# EAGLE design kludge2 (EAGLE 6.6.0)
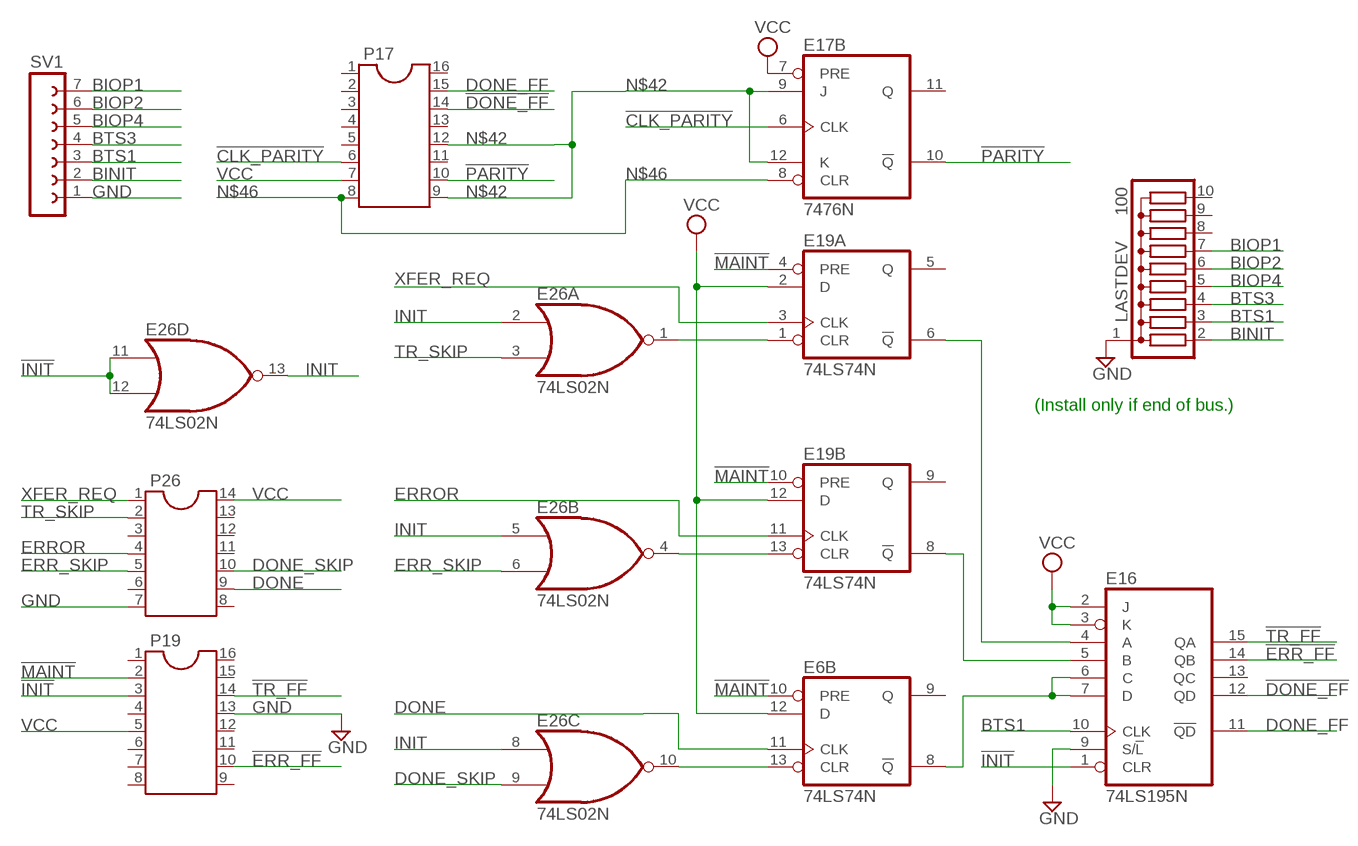
[diagram p0: schematic, sheet 1]

## Parts
E6  74LS74N  [DIL14]
E16  74LS195N  [DIL16]
E17  7476N  [DIL16]
E19  74LS74N  [DIL14]
E26  74LS02N  [DIL14]
LASTDEV  100  G09R  [SIL10]
P17  DIL16  [DIL16]
P19  DIL16  [DIL16]
P26  DIL14  [DIL14]
SV1  FE07-1  [FE07]

## Nets
!CLK_PARITY: E17.6(B:CLK) P17.6
!DONE_FF: E16.12(QD) P17.14
!ERR_FF: E16.14(QB) P19.10
!INIT: E16.1(CLR) E26.11(D:I0) E26.12(D:I1) P19.3
!MAINT: E6.10(B:PRE) E19.4(A:PRE) E19.10(B:PRE) P19.2
!PARITY: E17.10(B:!Q) P17.10
!TR_FF: E16.15(QA) P19.14
BINIT: LASTDEV.2 SV1.2
BIOP1: LASTDEV.7 SV1.7
BIOP2: LASTDEV.6 SV1.6
BIOP4: LASTDEV.5 SV1.5
BTS1: E16.10(CLK) LASTDEV.3 SV1.3
BTS3: LASTDEV.4 SV1.4
DONE: E6.11(B:CLK) P26.9
DONE_FF: E16.11(!QD) P17.15
DONE_SKIP: E26.9(C:I1) P26.10
ERR_SKIP: E26.6(B:I1) P26.5
ERROR: E19.11(B:CLK) P26.4
GND [supply]: E16.9(S/!L) LASTDEV.1 P19.13 P26.7 SV1.1
INIT: E26.2(A:I0) E26.5(B:I0) E26.8(C:I0) E26.13(D:O)
N$42: E17.9(B:J) E17.12(B:K) P17.9 P17.12
N$46: E17.8(B:CLR) P17.8
N$100: E16.4(A) E19.6(A:!Q)
N$103: E16.5(B) E19.8(B:!Q)
N$107: E6.8(B:!Q) E16.6(C) E16.7(D)
N$108: E19.1(A:CLR) E26.1(A:O)
N$110: E19.13(B:CLR) E26.4(B:O)
N$111: E6.13(B:CLR) E26.10(C:O)
TR_SKIP: E26.3(A:I1) P26.2
VCC [supply]: E6.12(B:D) E16.2(J) E16.3(K) E17.7(B:PRE) E19.2(A:D) E19.12(B:D) P17.7 P19.5 P26.14
XFER_REQ: E19.3(A:CLK) P26.1
Unconnected: E6.1(A:CLR) E6.2(A:D) E6.3(A:CLK) E6.4(A:PRE) E6.5(A:Q) E6.6(A:!Q) E6.9(B:Q) E16.13(QC) E17.1(A:CLK) E17.2(A:PRE) E17.3(A:CLR) E17.4(A:J) E17.11(B:Q) E17.14(A:!Q) E17.15(A:Q) E17.16(A:K) E19.5(A:Q) E19.9(B:Q) LASTDEV.8 LASTDEV.9 LASTDEV.10 P17.1 P17.2 P17.3 P17.4 P17.5 P17.11 P17.13 P17.16 P19.1 P19.4 P19.6 P19.7 P19.8 P19.9 P19.11 P19.12 P19.15 P19.16 P26.3 P26.6 P26.8 P26.11 P26.12 P26.13

## Notes on the sheet
- (Install only if end of bus.)

## Power pins joined to a net without a drawn wire
GND: E6.7(P:GND) E16.8(GND) E17.13(P:GND) E19.7(P:GND) E26.7(P:GND)
VCC: E6.14(P:VCC) E16.16(VCC) E17.5(P:VCC) E19.14(P:VCC) E26.14(P:VCC)

## Library data of the parts
E6 E19 = 74xx-us:74*74: Dual D type positive edge triggered FLIP FLOP, preset and clear
E16 = 74xx-us:74*195: 4-bit parallel access SHIFT REGISTER
E17 = 74xx-us:74*76: Dual J-K FLIP FLOP, preset and clear
E26 = 74xx-us:74*02: Quad 2-input NOR gate
LASTDEV = resistor-sil:G09R: SIL RESISTOR; OC_FARNELL: unknown; OC_NEWARK: unknown
P17 P19 = ic-package:DIL16: Dual In Line / Socket
P26 = ic-package:DIL14: Dual In Line / Socket
SV1 = con-lsta:FE07-1: FEMALE HEADER; OC_FARNELL: unknown; OC_NEWARK: unknown

## Net classes
1 supply: width 0.508 mm

## Board
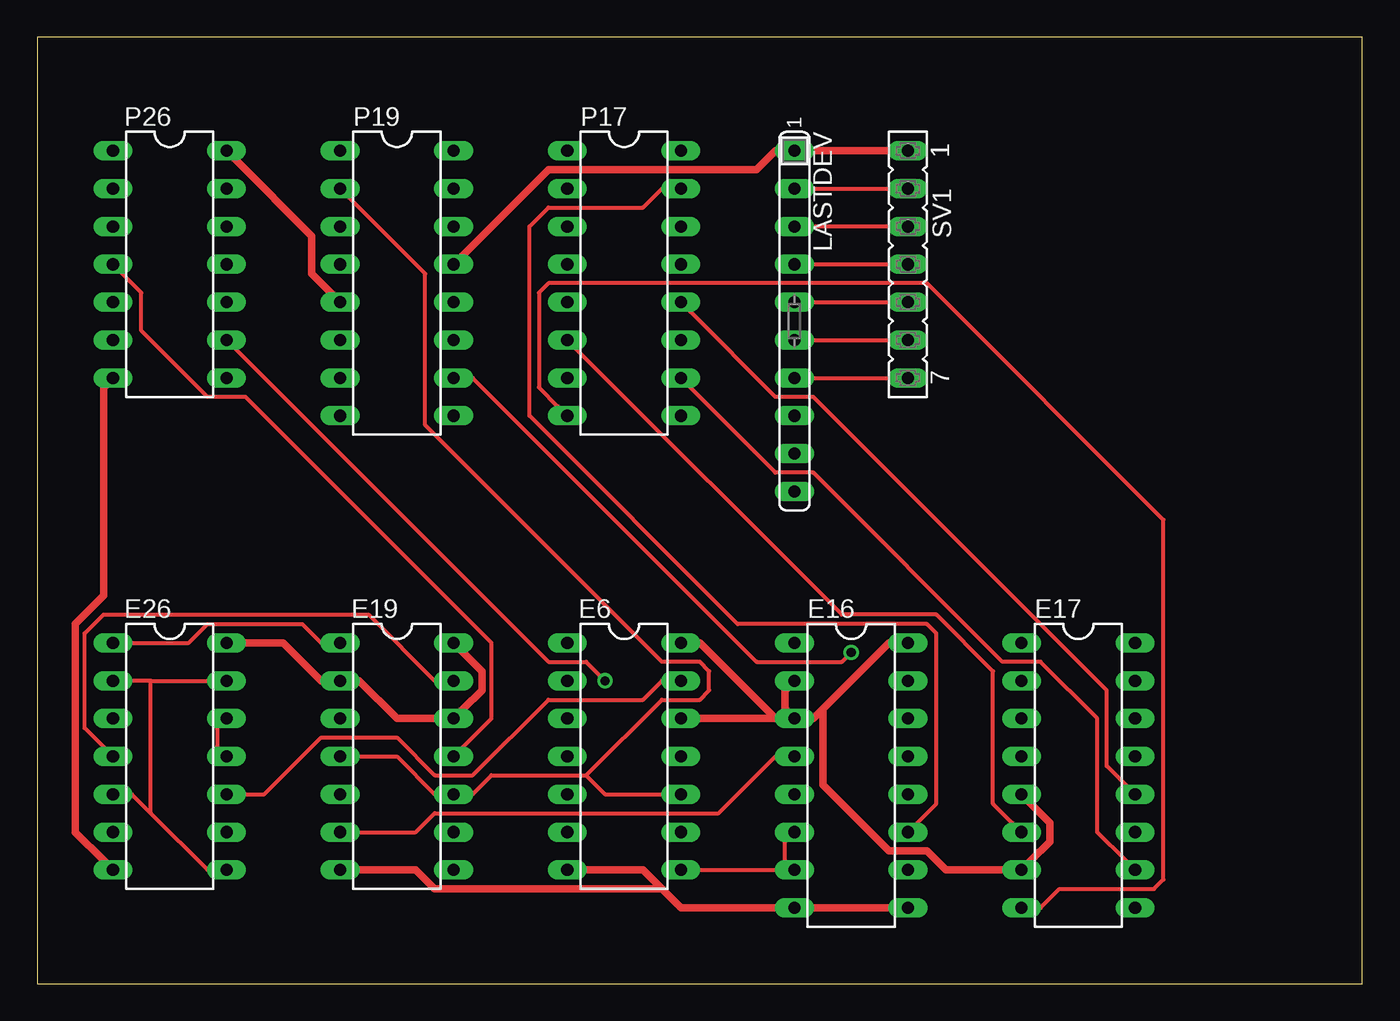
[diagram p1: board, top side]
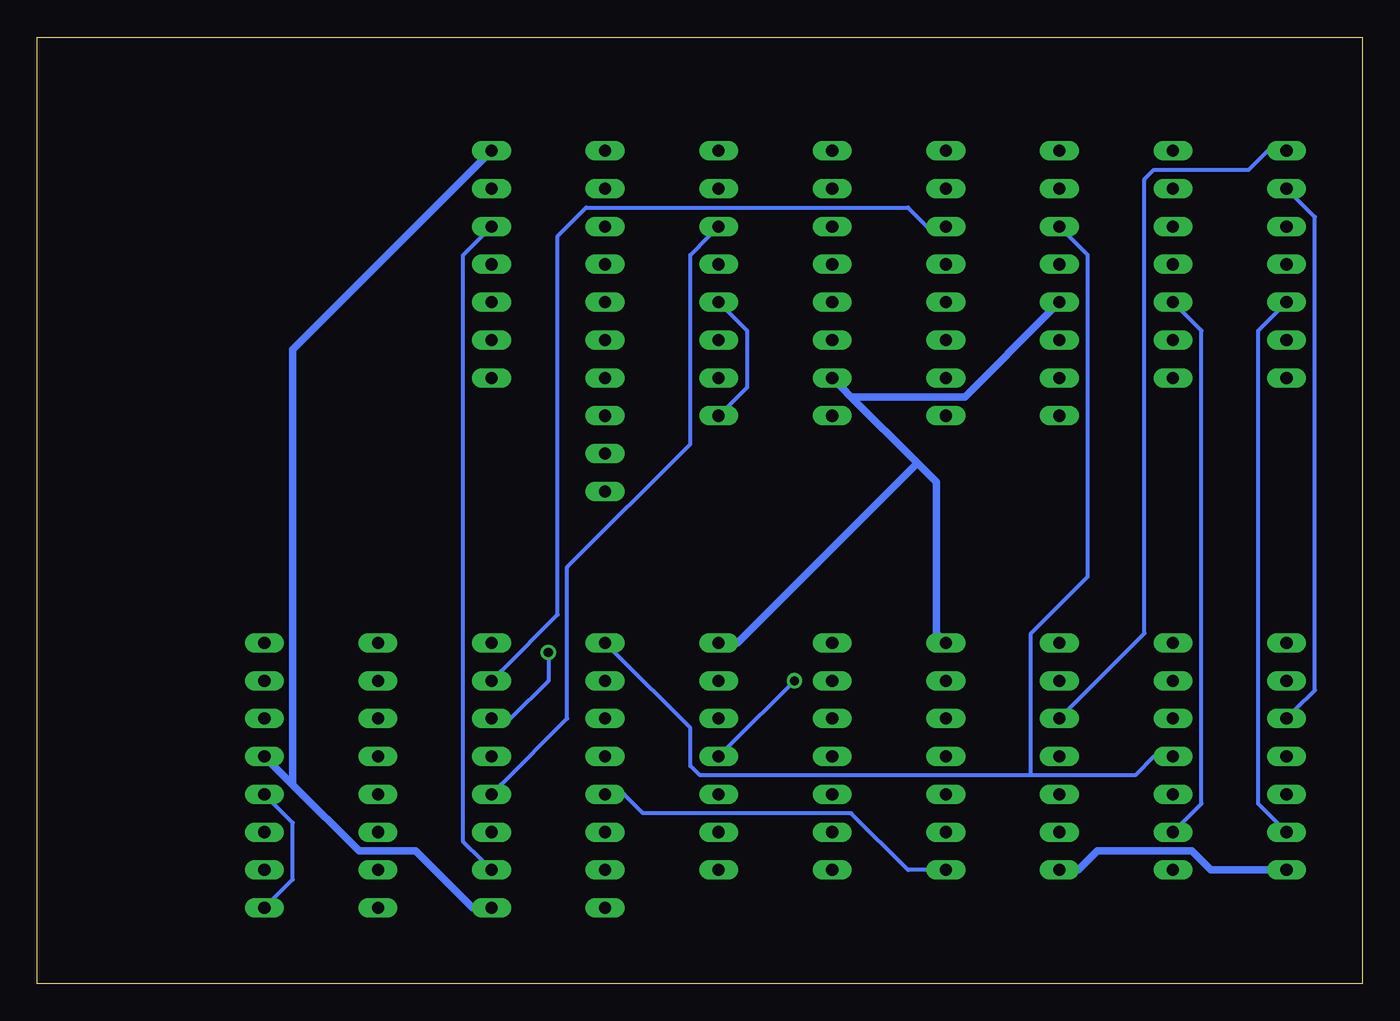
[diagram p2: board, bottom side, seen from below]

Size 88.9 x 63.5 mm. Coordinates in mm from the lower left corner, seen from the top.
Outline: 0,0 88.9,0 88.9,63.5 0,63.5 0,0
Copper layers (1*16): Top 0.035mm / dielectric 1.5mm / Bottom 0.035mm
Design rules "default": minimum track width 10mil, minimum drill 24mil, track to track 8mil, track to pad 8mil, pad to pad 8mil, via to via 8mil, smd to smd 8mil, copper to edge 40mil, drill to drill 8mil, minimum pad ring 10mil, minimum via ring 8mil, stop-mask expansion 4mil, vias tented up to drill 0mil, thermal gap 10mil

### Footprints (pad centres in the part's own frame; a part is rotated, then mirrored left to right if it is on the bottom)
DIL14 = drill 0.813 long: 1 -7.62,-3.81; 2 -5.08,-3.81; 3 -2.54,-3.81; 4 0,-3.81; 5 2.54,-3.81; 6 5.08,-3.81; 7 7.62,-3.81; 8 7.62,3.81; 9 5.08,3.81; 10 2.54,3.81; 11 0,3.81; 12 -2.54,3.81; 13 -5.08,3.81; 14 -7.62,3.81
DIL16 = drill 0.813 long: 1 -8.89,-3.81; 2 -6.35,-3.81; 3 -3.81,-3.81; 4 -1.27,-3.81; 5 1.27,-3.81; 6 3.81,-3.81; 7 6.35,-3.81; 8 8.89,-3.81; 9 8.89,3.81; 10 6.35,3.81; 11 3.81,3.81; 12 1.27,3.81; 13 -1.27,3.81; 14 -3.81,3.81; 15 -6.35,3.81; 16 -8.89,3.81
SIL10 = drill 0.813 long: 1 -11.43,0; 2 -8.89,0; 3 -6.35,0; 4 -3.81,0; 5 -1.27,0; 6 1.27,0; 7 3.81,0; 8 6.35,0; 9 8.89,0; 10 11.43,0
FE07 = drill 0.813 long: 1 -7.62,0; 2 -5.08,0; 3 -2.54,0; 4 0,0; 5 2.54,0; 6 5.08,0; 7 7.62,0

### Placement (x,y rotation side)
E6  39.37,15.24 270 top
E16  54.61,13.97 270 top
E17  69.85,13.97 270 top
E19  24.13,15.24 270 top
E26  8.89,15.24 270 top
LASTDEV  50.8,44.45 270 top
P17  39.37,46.99 270 top
P19  24.13,46.99 270 top
P26  8.89,48.26 270 top
SV1  58.42,48.26 270 top

### Tracks (layer width: path | path; a pad name or v marks a point on that pad's centre or on a via)
!CLK_PARITY
  Top 0.254: P17.6 36.2,42.55 53.98,24.77 60.33,24.77 64.14,20.95 64.14,12.06 65.41,10.79 E17.6
!DONE_FF
  Bottom 0.254: E16.12 57.78,13.34 53.34,17.78 53.34,27.94 45.09,36.2 45.09,48.9 43.81,50.16 P17.14
!ERR_FF  (via drill 0.61)
  Top 0.254: v54.61,22.23 53.98,21.59 48.26,21.59 29.21,40.64 P19.10
  Bottom 0.254: v54.61,22.23 54.61,20.32 57.15,17.78 E16.14
!INIT
  Top 0.254: E26.11 12.06,15.88 12.06,17.14 E26.12
  Bottom 0.254: 22.23,13.97 15.24,13.97 13.97,15.24 E26.11 | 22.23,13.97 44.45,13.97 45.09,14.61 45.09,17.14 50.16,22.23 E16.1 | 22.23,13.97 22.23,23.5 18.41,27.3 18.41,48.9 19.68,50.16 P19.3
!MAINT
  Top 0.254: E19.4 21.59,15.24 24.13,15.24 26.67,12.7 E19.10 29.21,12.7 30.48,13.97 36.83,13.97 | 36.83,13.97 38.1,12.7 41.91,12.7 E6.10 | 36.83,13.97 41.91,19.05 44.45,19.05 45.09,19.68 45.09,20.95 44.45,21.59 41.91,21.59 26.04,37.47 26.04,47.62 20.95,52.7 P19.2
!PARITY
  Top 0.254: P17.10 43.81,40.01 49.53,34.29 52.07,34.29 64.77,21.59 67.31,21.59 71.12,17.78 71.12,10.16 73.03,8.26 E17.10
!TR_FF
  Bottom 0.254: E16.15 57.78,20.95 53.98,24.77 53.98,50.16 52.07,52.07 30.48,52.07 29.21,50.8 P19.14
BINIT
  Top 0.254: LASTDEV.2 52.07,53.34 57.15,53.34 SV1.2
BIOP1
  Top 0.254: LASTDEV.7 52.07,40.64 57.15,40.64 SV1.7
BIOP2
  Top 0.254: LASTDEV.6 52.07,43.18 57.15,43.18 SV1.6
BIOP4
  Top 0.254: LASTDEV.5 52.07,45.72 57.15,45.72 SV1.5
BTS1
  Top 0.254: LASTDEV.3 52.07,50.8 57.15,50.8 SV1.3
  Bottom 0.254: E16.10 59.05,8.26 60.33,9.53 60.33,48.9 59.05,50.16 SV1.3
BTS3
  Top 0.254: LASTDEV.4 52.07,48.26 57.15,48.26 SV1.4
DONE  (via drill 0.61)
  Top 0.254: v38.1,20.32 36.83,21.59 34.29,21.59 13.34,42.55 P26.9
  Bottom 0.254: v38.1,20.32 42.55,15.88 E6.11
DONE_FF
  Top 0.254: E16.11 59.05,10.79 60.33,12.06 60.33,23.5 59.69,24.13 46.99,24.13 33.02,38.1 33.02,50.8 34.29,52.07 40.64,52.07 41.91,53.34 P17.15
DONE_SKIP
  Bottom 0.254: E26.9 12.06,10.79 10.79,12.06 10.79,43.81 12.06,45.09 P26.10
ERR_SKIP
  Bottom 0.254: E26.6 5.71,10.79 6.99,12.06 6.99,43.81 5.71,45.09 P26.5
ERROR
  Top 0.254: E19.11 28.57,15.88 30.48,17.78 30.48,22.86 13.97,39.37 11.43,39.37 6.99,43.81 6.99,46.35 5.71,47.62 P26.4
GND
  Top 0.508: P26.7 4.45,40.01 4.45,26.04 2.54,24.13 2.54,10.16 4.45,8.26 E26.7 | P19.13 28.57,48.9 34.29,54.61 48.26,54.61 49.53,55.88 LASTDEV.1 52.07,55.88 57.15,55.88 SV1.1 | E16.9 57.15,5.08 52.07,5.08 E16.8 49.53,5.08 43.18,5.08 41.91,6.35 | 41.91,6.35 40.64,7.62 36.83,7.62 E6.7 | 41.91,6.35 26.67,6.35 25.4,7.62 21.59,7.62 E19.7
  Bottom 0.508: E26.7 6.35,7.62 10.16,7.62 11.43,8.89 17.78,8.89 19.05,7.62 E19.7 | 71.75,13.34 67.31,8.89 63.5,8.89 59.69,5.08 E16.9 | 71.75,13.34 73.03,14.61 E17.13 | 71.75,13.34 71.75,42.55 59.05,55.24 SV1.1
INIT
  Top 0.254: 7.62,20.32 11.43,20.32 E26.13 | 7.62,20.32 6.35,20.32 E26.2 | 7.62,11.43 11.43,7.62 E26.8 | 7.62,11.43 6.35,12.7 E26.5 | 7.62,11.43 7.62,20.32
N$42
  Top 0.254: P17.12 43.81,45.09 49.53,39.37 52.07,39.37 71.75,19.68 71.75,14.61 73.03,13.34 E17.12
  Bottom 0.254: P17.9 42.55,38.73 41.27,40.01 41.27,43.81 42.55,45.09 P17.12 | E17.9 73.03,5.71 71.75,6.99 71.75,10.79 73.03,12.06 E17.12
N$46
  Top 0.254: P17.8 34.92,38.73 33.66,40.01 33.66,46.35 34.29,46.99 59.69,46.99 75.56,31.11 75.56,6.99 74.93,6.35 68.58,6.35 67.31,5.08 E17.8
N$100
  Top 0.254: E19.6 21.59,10.16 25.4,10.16 26.67,11.43 45.72,11.43 49.53,15.24 E16.4
N$103
  Bottom 0.254: E19.8 29.21,7.62 30.48,7.62 34.29,11.43 48.26,11.43 49.53,12.7 E16.5
N$107
  Top 0.254: E6.8 44.45,7.62 49.53,7.62 E16.7 50.16,8.26 50.16,9.53 E16.6
N$108
  Top 0.254: E26.1 6.35,22.86 10.16,22.86 11.43,24.13 17.78,24.13 19.05,22.86 E19.1
N$110
  Top 0.254: E26.4 4.45,15.88 3.17,17.14 3.17,23.5 4.45,24.77 22.23,24.77 26.67,20.32 E19.13
N$111
  Top 0.254: E26.10 13.97,12.7 15.24,12.7 19.05,16.51 24.13,16.51 26.67,13.97 29.21,13.97 34.29,19.05 40.64,19.05 41.91,20.32 E6.13
TR_SKIP
  Bottom 0.254: E26.3 4.45,18.41 3.17,19.68 3.17,51.44 4.45,52.7 P26.2
VCC
  Top 0.508: E17.5 66.67,12.06 67.94,10.79 67.94,9.53 66.67,8.26 E17.7 64.77,7.62 60.96,7.62 59.69,8.89 57.15,8.89 52.7,13.34 52.7,18.41 | 49.53,17.78 44.45,17.78 E6.12 | 49.53,17.78 E16.3 | 49.53,17.78 44.45,22.86 E6.14 | 49.53,17.78 E16.3 | E16.2 50.16,19.68 50.16,18.41 E16.3 | 52.7,18.41 52.07,17.78 E16.3 | 52.7,18.41 57.15,22.86 E16.16 | P26.14 13.34,55.24 18.41,50.16 18.41,47.62 19.68,46.35 P19.5 | E26.14 13.97,22.86 16.51,22.86 19.05,20.32 E19.2 21.59,20.32 24.13,17.78 26.67,17.78 E19.12 28.57,18.41 29.84,19.68 29.84,20.95 28.57,22.23 E19.14
  Bottom 0.508: 29.84,34.92 28.57,33.66 28.57,23.5 E19.14 | 29.84,34.92 34.29,39.37 | 34.29,39.37 34.92,40.01 P17.7 | 34.29,39.37 26.67,39.37 20.95,45.09 P19.5 | 29.84,34.92 41.91,22.86 E6.14
XFER_REQ
  Bottom 0.254: E19.3 19.68,18.41 14.61,23.5 14.61,53.98 13.97,54.61 7.62,54.61 6.35,55.88 P26.1